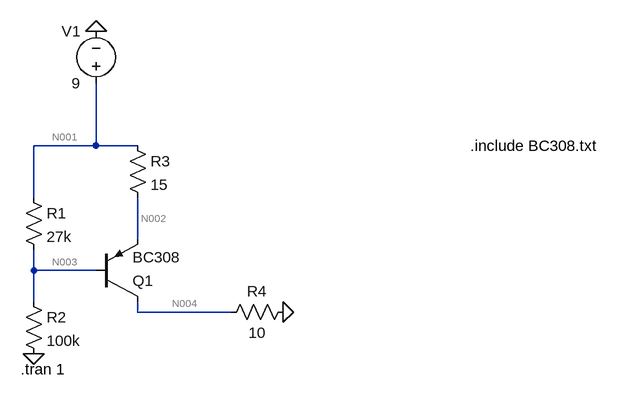
[diagram p0: schematic trial.asc]
trial.asc, the LTspice schematic file:
Version 4
SHEET 1 1016 680
WIRE 224 16 224 -80
WIRE 224 16 128 16
WIRE 288 16 224 16
WIRE 128 96 128 16
WIRE 288 160 288 96
WIRE 128 208 128 176
WIRE 224 208 128 208
WIRE 128 256 128 208
WIRE 288 272 288 256
WIRE 432 272 288 272
FLAG 224 -160 0
FLAG 128 336 0
FLAG 512 272 0
SYMBOL res 112 80 R0
SYMATTR InstName R1
SYMATTR Value 27k
SYMBOL res 112 240 R0
SYMATTR InstName R2
SYMATTR Value 100k
SYMBOL pnp 224 256 M180
SYMATTR InstName Q1
SYMATTR Value BC308
SYMBOL voltage 224 -64 R180
WINDOW 0 24 96 Left 2
WINDOW 3 24 16 Left 2
WINDOW 123 0 0 Left 0
WINDOW 39 0 0 Left 0
SYMATTR InstName V1
SYMATTR Value 9
SYMBOL res 272 0 R0
SYMATTR InstName R3
SYMATTR Value 15
SYMBOL res 528 256 R90
WINDOW 0 0 56 VBottom 2
WINDOW 3 32 56 VTop 2
SYMATTR InstName R4
SYMATTR Value 10
TEXT 800 16 Left 2 !.include BC308.txt
TEXT 108 360 Left 2 !.tran 1

The netlist it stands for:
* trial.asc
R1 N001 N003 27k
R2 N003 0 100k
Q1 N004 N003 N002 0 BC308
V1 N001 0 9
R3 N001 N002 15
R4 0 N004 10
.model NPN NPN
.model PNP PNP
.lib standard.bjt
.include BC308.txt
.tran 1
.backanno
.end

* Results of the author's LTspice run, read from the files saved beside the schematic
* Operating Point, zero values left out:
*   V(n001) = 9 V
*   V(n003) = 8.029 V
*   V(n004) = 175.3 mV
*   V(n002) = 8.736 V
*   Ic(Q1) = -17.53 mA
*   Ib(Q1) = -44.34 µA
*   Ie(Q1) = 17.58 mA
*   I(R1) = 35.95 µA
*   I(R2) = 80.29 µA
*   I(R3) = 17.58 mA
*   I(R4) = -17.53 mA
*   I(V1) = -17.61 mA